# Altium schematic sheet Power.SchDoc
size A
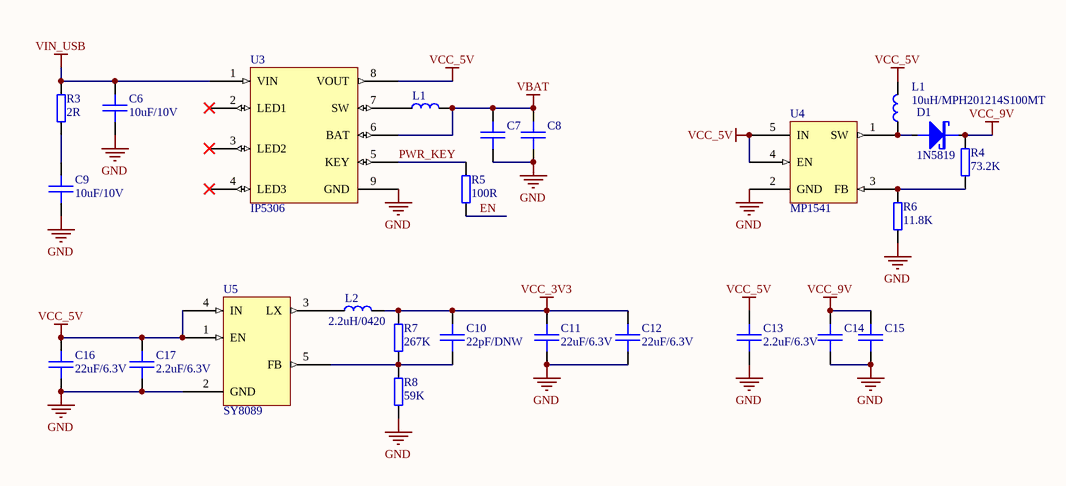
[diagram p0: Power.SchDoc]

## Parts
(Parts that share a designator on the sheet are numbered #1, #2 ... from top to bottom, then left to right.)
C6  10uF/10V  [SMT_C_0603]
C7  10uF/10V  [SMT_C_0603]  (value not drawn)
C8  10uF/10V  [SMT_C_0603]  (value not drawn)
C9  10uF/10V  [SMT_C_0603]
C10  22pF/DNW  [SMT_C_0402]
C11  22uF/6.3V  [SMT_C_0805]
C12  22uF/6.3V  [SMT_C_0805]
C13  2.2uF/6.3V  [SMT_C_0402]
C14  2.2uF/16V  [SMT_C_0603]  (value not drawn)
C15  2.2uF/16V  [SMT_C_0603]  (value not drawn)
C16  22uF/6.3V  [SMT_C_0805]
C17  2.2uF/6.3V  [SMT_C_0402]
D1  1N5819  [SMT_DIODE_SOD_323]
L1#1  1uH/PRS3015-1R0NT  [SMT_L_3.3mm]  (value not drawn)
L1#2  10uH/MPH201214S100MT  [SMT_FB_0805]
L2  2.2uH/0420  [SMT_L_3.3mm]
R3  2R  [SMT_R_0402]
R4  73.2K  [SMT_R_0402]
R5  100R  [SMT_R_0402]
R6  11.8K  [SMT_R_0402]
R7  267K  [SMT_R_0402]
R8  59K  [SMT_R_0402]
U3  IP5306  [AD620-SOP8]
U4  MP1541  [SOT95P280X100-5N]
U5  SY8089  [SOT23-5]

## Nets
GND: C6.2 C7.2 C8.2 C9.2 C11.2 C12.2 C13.2 C14.2 C15.2 C16.2 C17.2 R6.1 R8.1 U3.9(GND) U4.2(GND) U5.2(GND)
VBAT: C7.1 C8.1 L1#1.1 U3.6(BAT)
VCC_3V3: C10.1 C11.1 C12.1 L2.1 R7.2
VCC_5V: C13.1 C16.1 C17.1 L1#2.1 U3.8(VOUT) U4.4(EN) U4.5(IN) U5.1(EN) U5.4(IN)
VCC_9V: C14.1 C15.1 D1.2(K) R4.2
VIN_USB: C6.1 R3.1 U3.1(VIN)
EN: R5.1
PWR_KEY: R5.2 U3.5(KEY)
NetC9_1: C9.1 R3.2
NetC10_2: C10.2 R7.1 R8.2 U5.5(FB)
NetD1_1: D1.1(A) L1#2.2 U4.1(SW)
NetL1#1_2: L1#1.2 U3.7(SW)
NetL2_2: L2.2 U5.3(LX)
NetR4_1: R4.1 R6.2 U4.3(FB)

Not connected (* = marked no-connect by the designer): U3 2(LED1)* 3(LED2)* 4(LED3)*

## Library data of the parts
C6-C9 C14 C15 = SMT_C_0603: Surface mount capacitor 0603
C10 C13 C17 = SMT_C_0402: Surface mount capacitor 0402
C11 C12 C16 = SMT_C_0805: Surface mount capacitor 0805
D1 = SMT_DIODE_SCHOTTKY_SOD_323: Surface mount schottky diode SOD-323(0805) Package
L1#1 = SMT_L_3.0mm: SMT Power Inductor, 3.3x3.3x1mm
L1#2 = SMT_FB_0805: Surface mount ferrite beads 0805
L2 = SMT_L_3.3mm: LPO3310 SMT Power Inductor, 3.3x3.3x1mm
R3 = SMT_R_0603: Surface mount resistor 0603
R4-R8 = SMT_R_0402: Surface mount resistor 0402
U5 = SY8089: High Efficiency 5.5V, 2A continuous, 3A peak, 1MHz  Synchronous Step Down Regulator